# Altium schematic sheet 447Schematic.SchDoc
size A
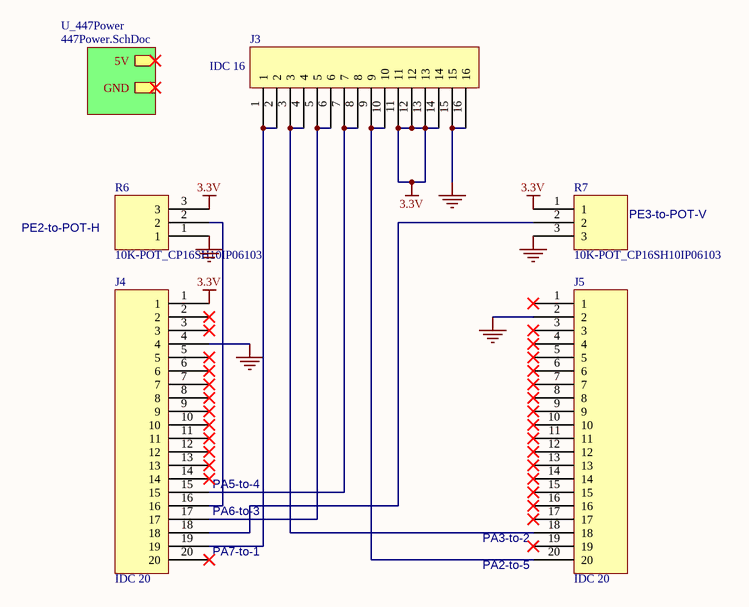
[diagram p0: 447Schematic.SchDoc]

## Parts
J3  IDC 16  [IDC16]
J4  IDC 20  [IDC20]
J5  IDC 20  [IDC20]
R6  10K-POT_CP16SH10IP06103  [POT (5mmPitch)]
R7  10K-POT_CP16SH10IP06103  [POT (5mmPitch)]

## Sub-sheets
U_447Power = 447Power.SchDoc: 5V (out), GND

## Nets
3.3V: J3.11 J3.12 J3.13 J3.14 J4.1 R6.3 R7.1
GND: J3.15 J3.16 J4.4 J5.2 R6.1 R7.3
NetJ3_1: J3.1 J3.2 J4.19
NetJ3_3: J3.3 J3.4 J5.18
NetJ3_5: J3.5 J3.6 J4.17
NetJ3_7: J3.7 J3.8 J4.15
NetJ3_9: J3.9 J3.10 J5.20
NetJ4_16: J4.16 R6.2
NetJ4_18: J4.18 R7.2

Not connected (* = marked no-connect by the designer): J4 2* 3* 5* 6* 7* 8* 9* 10* 11* 12* 13* 14* 20*; J5 1* 3* 4* 5* 6* 7* 8* 9* 10* 11* 12* 13* 14* 15* 16* 17* 19*

## Notes on the sheet
- PE3-to-POT-V
- PE2-to-POT-H
- (near J4) PA5-to-4
- (near J4) PA7-to-1
- (near J4) PA6-to-3
- (near J5) PA3-to-2
- (near J5) PA2-to-5

## Library data of the parts
J3 = 3020-16-0100-00: IDC BOX HEADER .100" 16POS; Manufacturer: CNC Tech; Connector Type: Header, Shrouded; Number of Positions: 16; Number of Positions Loaded: All; Pitch: 0.100" (2.54mm); Supplier 1: Digi-Key; Manufacturer Part Number: 3020-16-0100-00; RoHS: RoHS Compliant; Category: Connectors, Interconnects; Stock 1: 4144; Pricing 1: 1=0.58, 10=0.54, 50=0.432, 100=0.414, 250=0.378, 500=0.36, 1000=0.297, 2500=0.27, 5000=0.261 (USD); Packaging: Tray; Contact Type: Male Pin; Number of Rows: 2; Row Spacing: 0.100" (2.54mm); Contact Mating Length: -; Mounting Type: Through Hole; Termination: Solder; Fastening Type: -; Features: -; Contact Finish: Gold; Contact Finish Thickness: Flash; Color: -; ComponentLink1URL: http://cnctech.us/pdfs/3020-XX-0100-00.pdf; ComponentLink1Description: http://cnctech.us/pdfs/3020-XX-0100-00.pdf; Supplier Part Number 1: 1175-1611-ND
J4 J5 = 3020-20-0100-00: IDC BOX HEADER .100" 20POS; Manufacturer: CNC Tech; Connector Type: Header, Shrouded; Number of Positions: 20; Number of Positions Loaded: All; Pitch: 0.100" (2.54mm); Supplier 1: Digi-Key; Manufacturer Part Number: 3020-20-0100-00; RoHS: RoHS Compliant; Category: Connectors, Interconnects; Stock 1: 5668; Pricing 1: 1=0.67, 10=0.63, 50=0.504, 100=0.483, 250=0.441, 500=0.42, 1000=0.3465, 2500=0.315, 5000=0.3045 (USD); Packaging: Tray; Contact Type: Male Pin; Number of Rows: 2; Row Spacing: 0.100" (2.54mm); Contact Mating Length: -; Mounting Type: Through Hole; Termination: Solder; Fastening Type: -; Features: -; Contact Finish: Gold; Contact Finish Thickness: Flash; Color: -; ComponentLink1URL: http://cnctech.us/pdfs/3020-XX-0100-00.pdf; ComponentLink1Description: http://cnctech.us/pdfs/3020-XX-0100-00.pdf; Supplier Part Number 1: 1175-1612-ND
R6 R7 = CP16SH10IP06103: POT 10K OHM 1/5W CARBON LINEAR; Manufacturer: TE Connectivity Passive Product; Tolerance: ±20%; Power (Watts): 0.2W, 1/5W; Built in Switch: None; Adjustment Type: Side Adjustment; Temperature Coefficient: ±300ppm/°C; Rotation: 300°; Actuator Type: Knurled; Actuator Length: 1.772" (45.00mm); Actuator Diameter: 0.236" (6.00mm); Bushing Thread: M10 x 0.75; Supplier 1: Digi-Key; Manufacturer Part Number: CP16SH10IP06103; RoHS: RoHS Compliant; Category: Potentiometers, Variable Resistors; Stock: 0; Pricing 1: 500=2.5666 (USD); Packaging: Bulk; Part Status: Active; Resistance (Ohms): 10k; Taper: Linear; Resistive Material: Carbon; Termination Style: PC Pins; Mounting Type: Panel Mount; Size - Body: Rectangular - 0.707" x 0.630" Face x 0.807" H (18.00mm x 16.00mm x 20.50mm); ComponentLink1URL: https://www.te.com/commerce/DocumentDelivery/DDEController?Action=srchrtrv&DocNm=1676003&DocType=Customer+Drawing&DocLang=English; ComponentLink1Description: https://www.te.com/commerce/DocumentDelivery/DDEController?Action=srchrtrv&DocNm=1676003&DocType=Customer+Drawing&DocLang=English; Supplier Part Number 1: CP16SH10IP06103-ND